# EAGLE design GabozePocaioUpgrade (EAGLE 9.0.0)
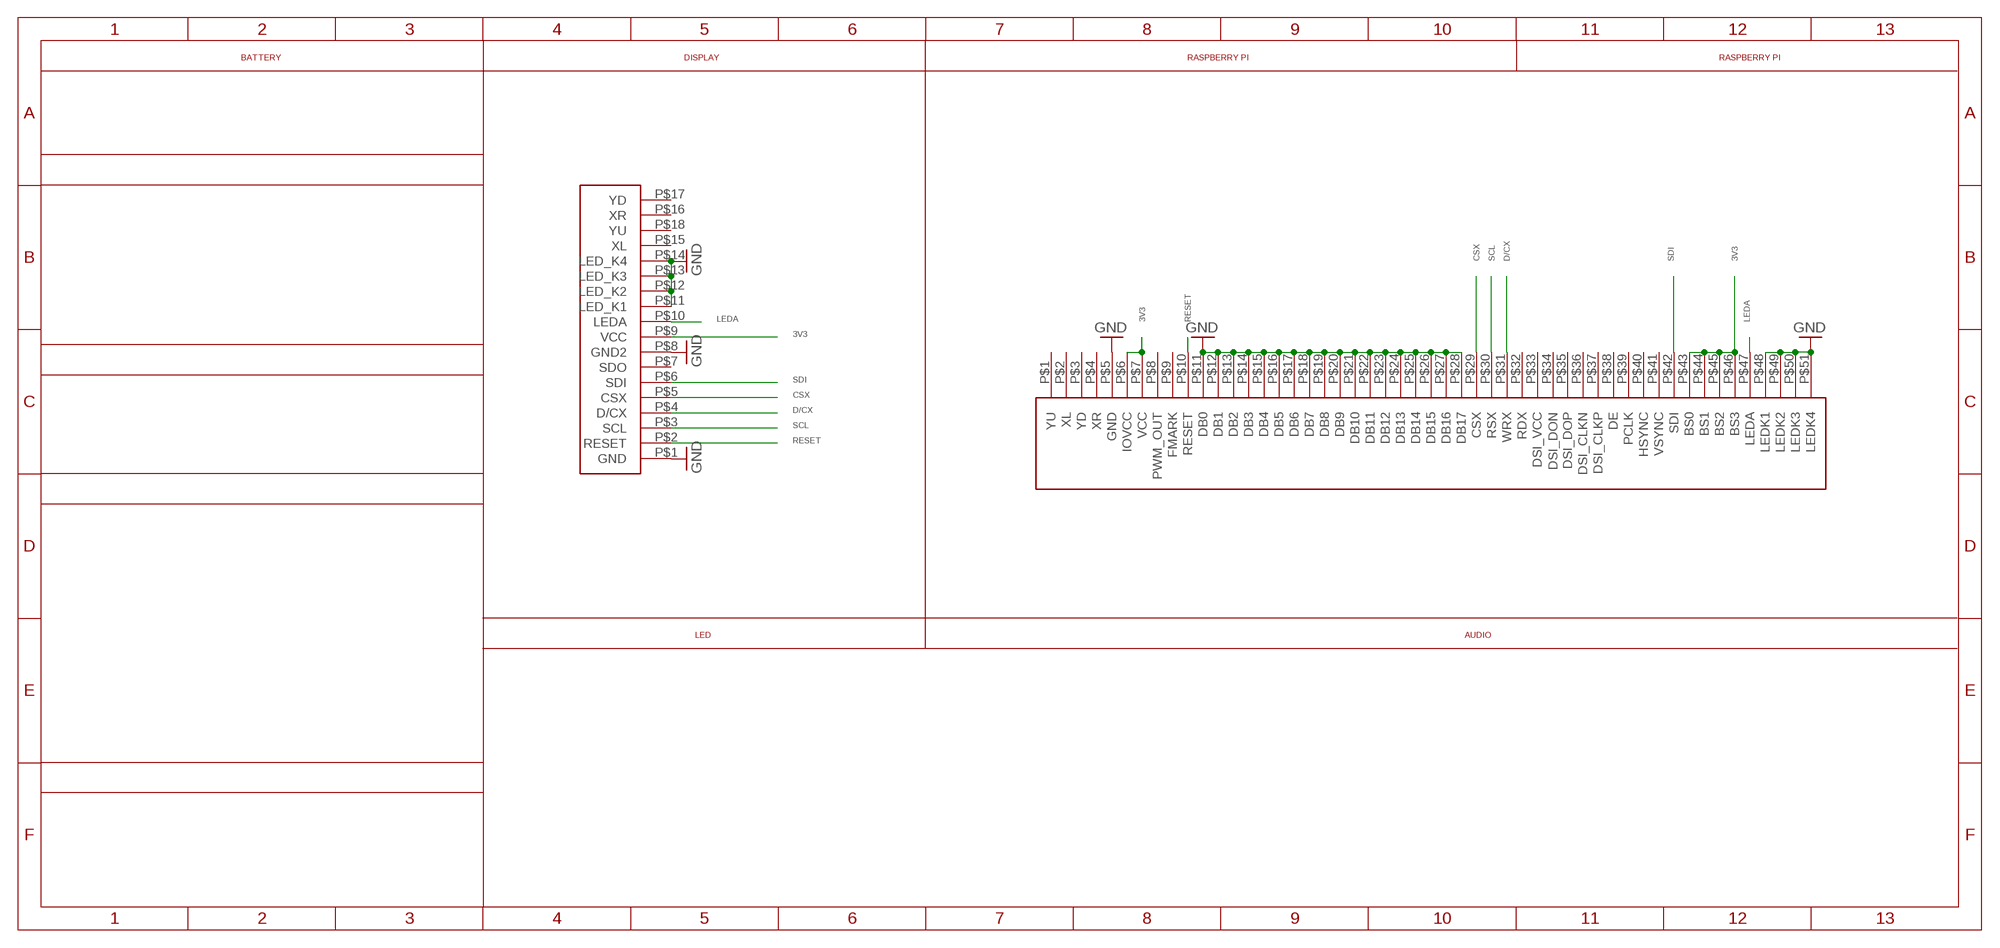
[diagram p0: schematic, sheet 1]

## Parts
SCREEN1  TFT-DISPLAY-2.4TFT-DISPLAY-2.4-HOLES  [TFT-DISPLAY-2.4-HOLES]
U$2  TFT-DISPLAY-2.6-51PIN  [TFT-DISPLAY-2.6-51PIN]

## Nets
3V3: SCREEN1.P$9(VCC) U$2.P$6(IOVCC) U$2.P$7(VCC) U$2.P$43(BS0) U$2.P$44(BS1) U$2.P$45(BS2) U$2.P$46(BS3)
CSX: SCREEN1.P$5(CSX) U$2.P$29(CSX)
D/CX: SCREEN1.P$4(D/CX) U$2.P$31(WRX)
GND: SCREEN1.P$1(GND) SCREEN1.P$8(GND2) SCREEN1.P$11(LED_K1) SCREEN1.P$12(LED_K2) SCREEN1.P$13(LED_K3) SCREEN1.P$14(LED_K4) U$2.P$5(GND) U$2.P$11(DB0) U$2.P$12(DB1) U$2.P$13(DB2) U$2.P$14(DB3) U$2.P$15(DB4) U$2.P$16(DB5) U$2.P$17(DB6) U$2.P$18(DB7) U$2.P$19(DB8) U$2.P$20(DB9) U$2.P$21(DB10) U$2.P$22(DB11) U$2.P$23(DB12) U$2.P$24(DB13) U$2.P$25(DB14) U$2.P$26(DB15) U$2.P$27(DB16) U$2.P$28(DB17) U$2.P$48(LEDK1) U$2.P$49(LEDK2) U$2.P$50(LEDK3) U$2.P$51(LEDK4)
LEDA: SCREEN1.P$10(LEDA) U$2.P$47(LEDA)
RESET: SCREEN1.P$2(RESET) U$2.P$10(RESET)
SCL: SCREEN1.P$3(SCL) U$2.P$30(RSX)
SDI: SCREEN1.P$6(SDI) U$2.P$42(SDI)
Unconnected: SCREEN1.P$7(SDO) SCREEN1.P$15(XL) SCREEN1.P$16(XR) SCREEN1.P$17(YD) SCREEN1.P$18(YU) U$2.P$1(YU) U$2.P$2(XL) U$2.P$3(YD) U$2.P$4(XR) U$2.P$8(PWM_OUT) U$2.P$9(FMARK) U$2.P$32(RDX) U$2.P$33(DSI_VCC) U$2.P$34(DSI_DON) U$2.P$35(DSI_DOP) U$2.P$36(DSI_CLKN) U$2.P$37(DSI_CLKP) U$2.P$38(DE) U$2.P$39(PCLK) U$2.P$40(HSYNC) U$2.P$41(VSYNC)

## Notes on the sheet
- BATTERY | DISPLAY | RASPBERRY PI | RASPBERRY PI
- LED | AUDIO

## Library data of the parts
SCREEN1 = 32teeth - TFT Displays:TFT-DISPLAY-2.4
U$2 = 32teeth - 2.6" TFT 51P:TFT-DISPLAY-2.6-51PIN: ILI9342 51P 2.6" TFT LCD

## Board
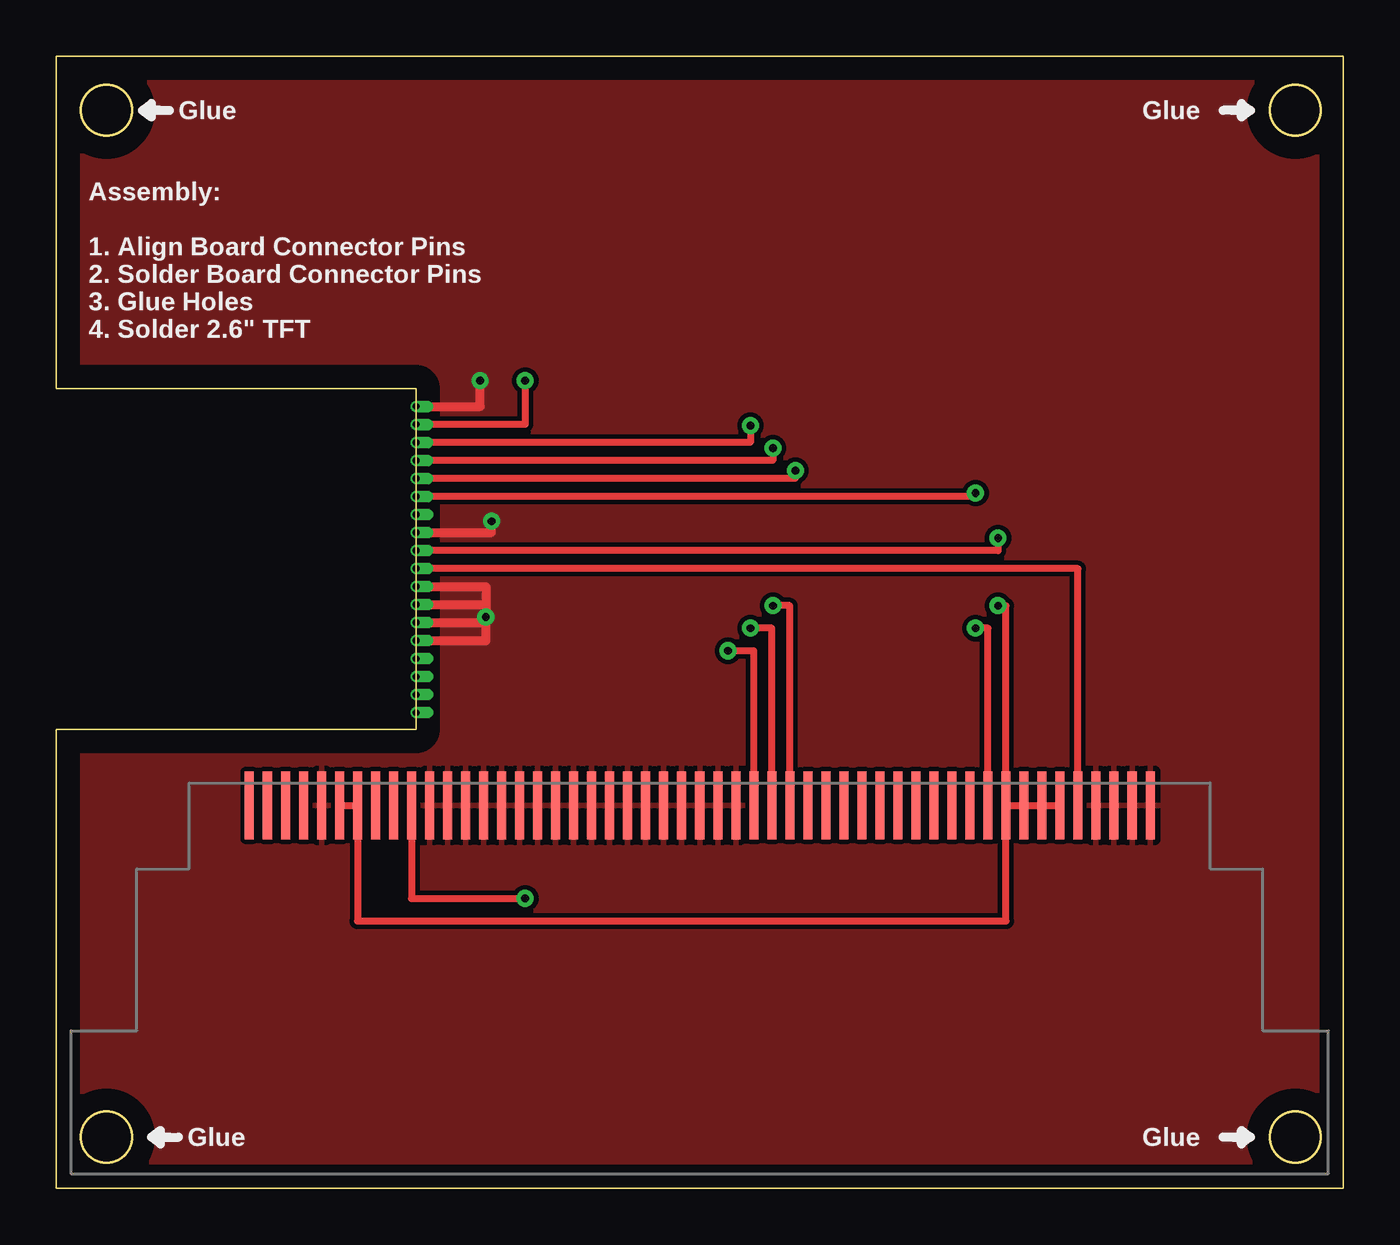
[diagram p1: board, top side]
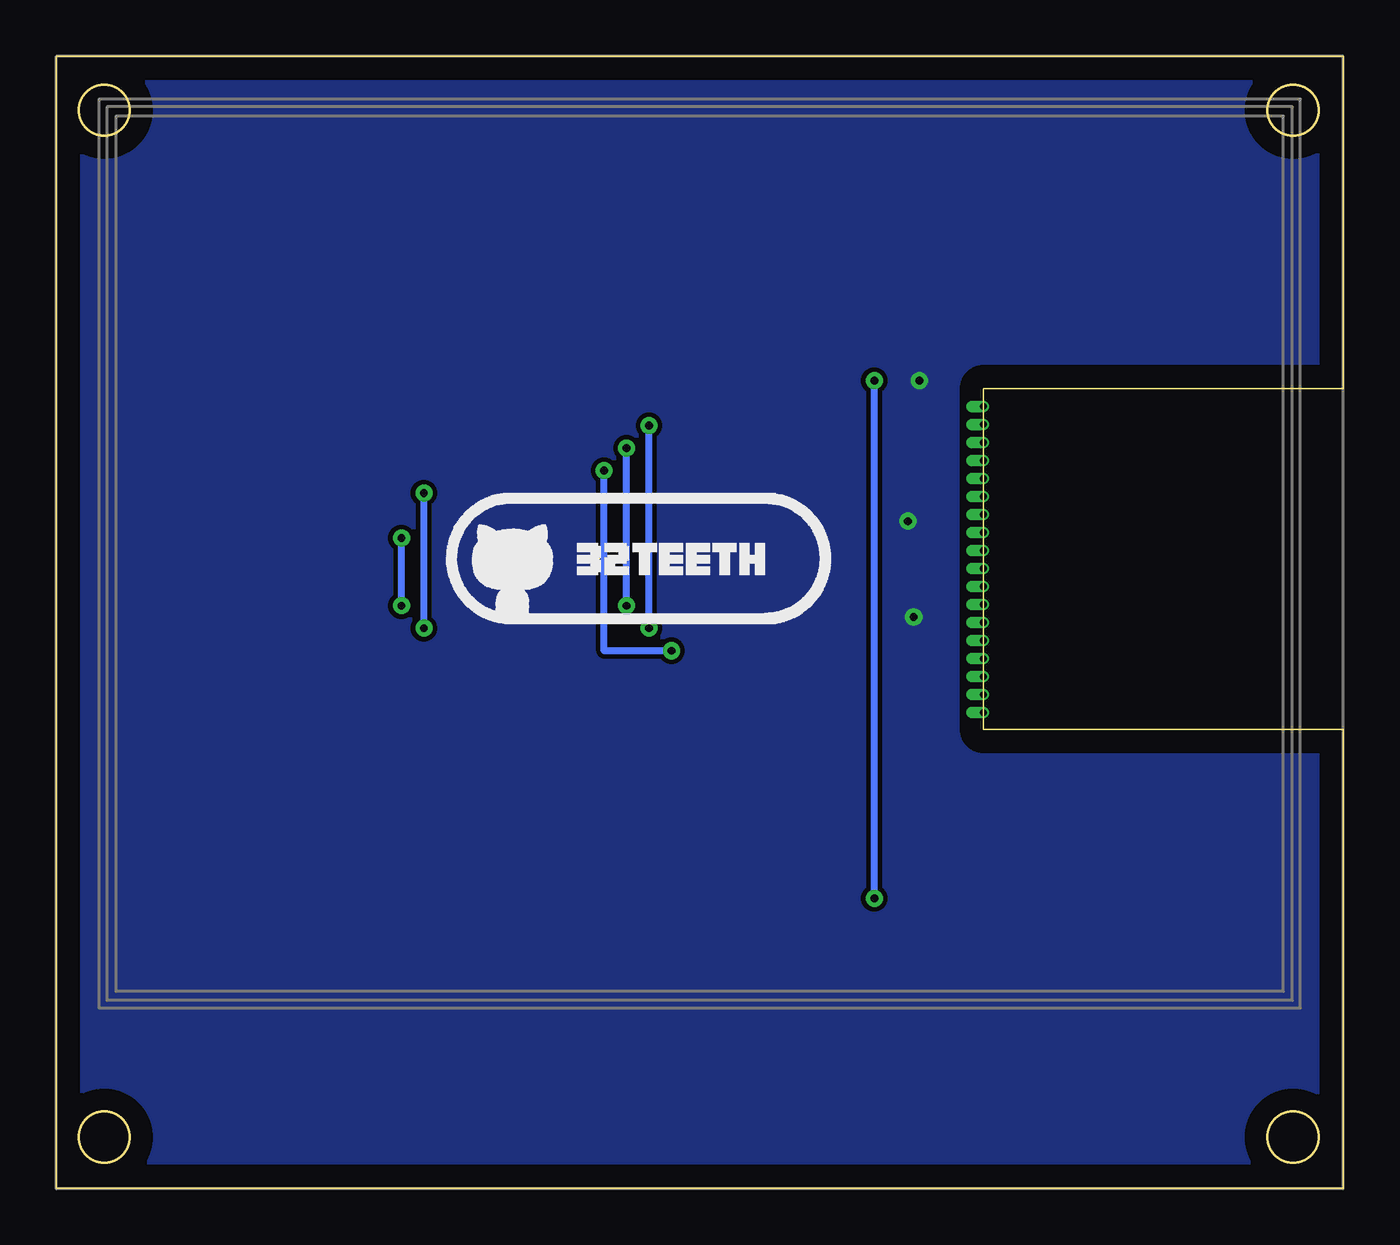
[diagram p2: board, bottom side, seen from below]

Size 57.15 x 50.27 mm. Coordinates in mm from the lower left corner, seen from the top.
Outline: 0,50.27 57.15,50.27 57.15,0 0,0 0,20.38 15.97,20.38 15.97,35.52 0,35.52 0,50.27
Outline: circle at 2.23,2.27 radius 1.13
Outline: circle at 2.23,47.88 radius 1.13
Outline: circle at 55.03,47.88 radius 1.13
Outline: circle at 55.03,2.27 radius 1.13
Copper layers (1*16): Top 0.035mm / dielectric 1.5mm / Bottom 0.035mm
Design rules "default *": minimum track width 10mil, minimum drill 24mil, track to track 8mil, track to pad 8mil, pad to pad 8mil, via to via 8mil, smd to smd 8mil, copper to edge 40mil, drill to drill 8mil, minimum pad ring 4mil, minimum via ring 8mil, stop-mask expansion 5mil, vias tented up to drill 10mil, thermal gap 10mil

### Footprints (pad centres in the part's own frame; a part is rotated, then mirrored left to right if it is on the bottom)
TFT-DISPLAY-2.4-HOLES = drill 0.3 pad 0.4 offset: P$1 -13.1,6.8; P$2 -13.1,6; P$3 -13.1,5.2; P$4 -13.1,4.4; P$5 -13.1,3.6; P$6 -13.1,2.8; P$7 -13.1,2; P$8 -13.1,1.2; P$9 -13.1,0.4; P$10 -13.1,-0.4; P$11 -13.1,-1.2; P$12 -13.1,-2; P$13 -13.1,-2.8; P$14 -13.1,-3.6; P$15 -13.1,-4.4; P$16 -13.1,-5.2; P$17 -13.1,-6; P$18 -13.1,-6.8
TFT-DISPLAY-2.6-51PIN = smd 0.4 x 3: P$1 -20,-8.12; P$2 -19.2,-8.12; P$3 -18.4,-8.12; P$4 -17.6,-8.12; P$5 -16.8,-8.12; P$6 -16,-8.12; P$7 -15.2,-8.12; P$8 -14.4,-8.12; P$9 -13.6,-8.12; P$10 -12.8,-8.12; P$11 -12,-8.12; P$12 -11.2,-8.12; P$13 -10.4,-8.12; P$14 -9.6,-8.12; P$15 -8.8,-8.12; P$16 -8,-8.12; P$17 -7.2,-8.12; P$18 -6.4,-8.12; P$19 -5.6,-8.12; P$20 -4.8,-8.12; P$21 -4,-8.12; P$22 -3.2,-8.12; P$23 -2.4,-8.12; P$24 -1.6,-8.12; P$25 -0.8,-8.12; P$26 0,-8.12; P$27 0.8,-8.12; P$28 1.6,-8.12; P$29 2.4,-8.12; P$30 3.2,-8.12; P$31 4,-8.12; P$32 4.8,-8.12; P$33 5.6,-8.12; P$34 6.4,-8.12; P$35 7.2,-8.12; P$36 8,-8.12; P$37 8.8,-8.12; P$38 9.6,-8.12; P$39 10.4,-8.12; P$40 11.2,-8.12; P$41 12,-8.12; P$42 12.8,-8.12; P$43 13.6,-8.12; P$44 14.4,-8.12; P$45 15.2,-8.12; P$46 16,-8.12; P$47 16.8,-8.12; P$48 17.6,-8.12; P$49 18.4,-8.12; P$50 19.2,-8.12; P$51 20,-8.12

### Placement (x,y rotation side)
SCREEN1  29.07,27.93 0 top
U$2  28.57,25.12 0 top

### Tracks (layer width: path | path; a pad name or v marks a point on that pad's centre or on a via)
3V3  (via drill 0.35)
  Top 0.305: U$2.P$6 U$2.P$7 13.38,11.88 42.18,11.88 U$2.P$43 | U$2.P$43 U$2.P$44 U$2.P$45 U$2.P$46 | U$2.P$43 42.18,25.88 v41.83,25.88 | v41.83,28.88 41.83,28.32 SCREEN1.P$9
  Bottom 0.305: v41.83,25.88 v41.83,28.88
CSX  (via drill 0.35)
  Top 0.305: U$2.P$29 30.97,23.88 v29.82,23.88 | v32.83,31.88 32.83,31.52 SCREEN1.P$5
  Bottom 0.305: v29.82,23.88 32.83,23.88 v32.83,31.88
D/CX  (via drill 0.35)
  Top 0.305: U$2.P$31 32.58,25.88 v31.82,25.88 | v31.82,32.88 31.82,32.33 SCREEN1.P$4
  Bottom 0.305: v31.82,25.88 v31.82,32.88
GND  (via drill 0.35)
  Top 0.406: SCREEN1.P$14 19.07,24.32 v19.07,25.38 | SCREEN1.P$13 19.07,25.12 v19.07,25.38 | SCREEN1.P$12 19.07,25.93 v19.07,25.38 | SCREEN1.P$11 19.07,26.73 v19.07,25.38 | SCREEN1.P$8 19.32,29.12 v19.32,29.62 | SCREEN1.P$1 18.82,34.73 v18.82,35.88
  pour Top: -0.17,50.88 57.83,50.88 57.83,-0.12 -0.17,-0.12
  pour Bottom: -0.17,50.88 57.83,50.88 57.83,-0.12 -0.17,-0.12
LEDA
  Top 0.305: U$2.P$47 45.38,27.52 SCREEN1.P$10
RESET  (via drill 0.35)
  Top 0.305: U$2.P$10 15.77,12.88 v20.82,12.88 | v20.82,35.88 20.82,33.92 SCREEN1.P$2
  Bottom 0.305: v20.82,12.88 v20.82,35.88
SCL  (via drill 0.35)
  Top 0.305: U$2.P$30 31.77,24.88 v30.82,24.88 | v30.82,33.88 30.82,33.12 SCREEN1.P$3
  Bottom 0.305: v30.82,24.88 v30.82,33.88
SDI  (via drill 0.35)
  Top 0.305: U$2.P$42 41.38,24.88 v40.83,24.88 | v40.83,30.88 40.83,30.73 SCREEN1.P$6
  Bottom 0.305: v40.83,24.88 v40.83,30.88

### Text on the board
tPlace: Glue | Glue | Assembly: / / 1. Align Board Connector Pins / 2. Solder Board Connector Pins / 3. Glue Holes / 4. Solder 2.6" TFT | Glue | Glue